# Altium schematic sheet power.SchDoc
size A4
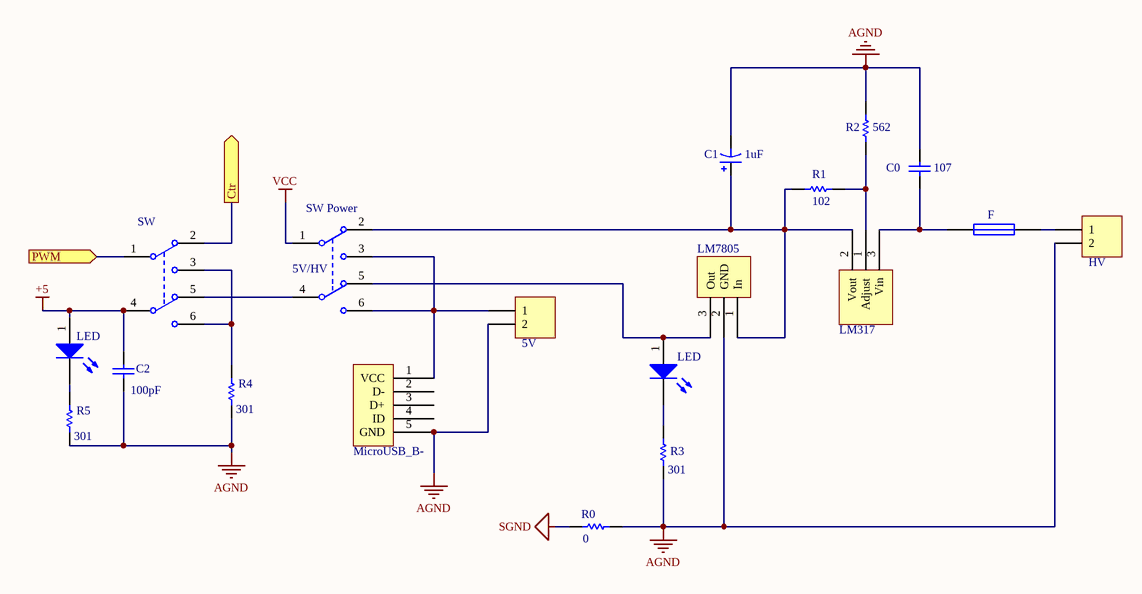
[diagram p0: power.SchDoc]

## Parts
C0  value 107  [0805(M)]  (hidden comment: Cap2)
C1  value 1uF  [25V47uF(DIP)]  (hidden comment: Cap1)
C2  value 100pF  [0805(M)]  (hidden comment: Cap2)
F  Fuse  [1812(M)]  (value not drawn)
LED0  LED  [0805_(M)]
LED1  LED  [0805_(M)]
LM0  LM317  [TO220(DIP)]
LM1  LM7805  [TO220(DIP)]
R0  value 0  [0805(M)]  (hidden comment: Res)
R1  value 102  [0805(M)]  (hidden comment: Res)
R2  value 562  [0805(M)]  (hidden comment: Res)
R3  value 301  [0805(M)]  (hidden comment: Res)
R4  value 301  [0805(M)]  (hidden comment: Res)
R5  value 301  [0805(M)]  (hidden comment: Res)
SW  AFT-03(8*8)  [AFT-03(DIP)]  (value not drawn)
SW_Power  AFT-03(8*8)  [AFT-03(DIP)]  (value not drawn)
Ter2P0  HV  [KF301-2P(DIP)]
Ter2P1  5V  [KF301-2P(DIP)]
USB0  MicroUSB_B-  [MicroUSB_B-(M)]

## Ports
Ctr (out), PWM (in)

## Nets
+5: C2.2 LED1.1(P) SW.4(COMMON2)
AGND: C0.1 C1.2 C2.1 LM1.2(GND) R0.2 R2.2 R3.2 R4.2 R5.2 Ter2P0.2 Ter2P1.2 USB0.5(GND)
SGND: R0.1
VCC: SW_Power.1(COMMON1)
Ctr: SW.2(NC1) ; port Ctr
PWM: SW.1(COMMON1) ; port PWM
NetC0_2: C0.2 F.1 LM0.3(Vin)
NetC1_1: C1.1 LM0.2(Vout) LM1.1(In) R1.2 SW_Power.2(NC1)
NetF_2: F.2 Ter2P0.1
NetLED0_1: LED0.1(P) LM1.3(Out) SW_Power.5(NC2)
NetLED0_2: LED0.2(N) R3.1
NetLED1_2: LED1.2(N) R5.1
NetLM0_1: LM0.1(Adjust) R1.1 R2.1
NetR4_1: R4.1 SW.3(NO1) SW.6(NO2)
NetSW_5: SW.5(NC2) SW_Power.4(COMMON2)
NetSW_Power_3: SW_Power.3(NO1) SW_Power.6(NO2) Ter2P1.1 USB0.1(VCC)

Not connected (* = marked no-connect by the designer): USB0 2(D-) 3(D+) 4(ID)

## Notes on the sheet
- (near SW_Power) 5V/HV

## Library data of the parts
C0 C2 = Cap2: 非极性电容
C1 = Cap1: 极性电容
F = Fuse: 保险丝
LM0 = LM317*: 三端稳压(可调)
LM1 = LM7805*: 三端稳压
SW SW_Power = AFT-03(8*8): 双刀双掷(DPDT)
Ter2P0 Ter2P1 = KF301-2P: 接线端子 脚距5.08MM 300V/16A
USB0 = MicroUSB_B-: 母头